# Altium schematic sheet Communication.SchDoc: Плата отладочная для выполнения лабораторных работ
size 420 x 297 mm; CheckedBy: Смирнов А. Н.; Author: Самарин И. Д.; CompanyName: МЭИ ЭР-02м-18; Address1: Address1; Address2: Address2; Address3: Address3; Address4: Address4; DocumentNumber: МЭИ.466219.001 Э3; SheetNumber: 5; Scale: 1:1; Title2str: по курсу "Информационная электроника"; DocumentType: Схема электрическая принципиальная; FirstReferrence: АБВГ.123456.001
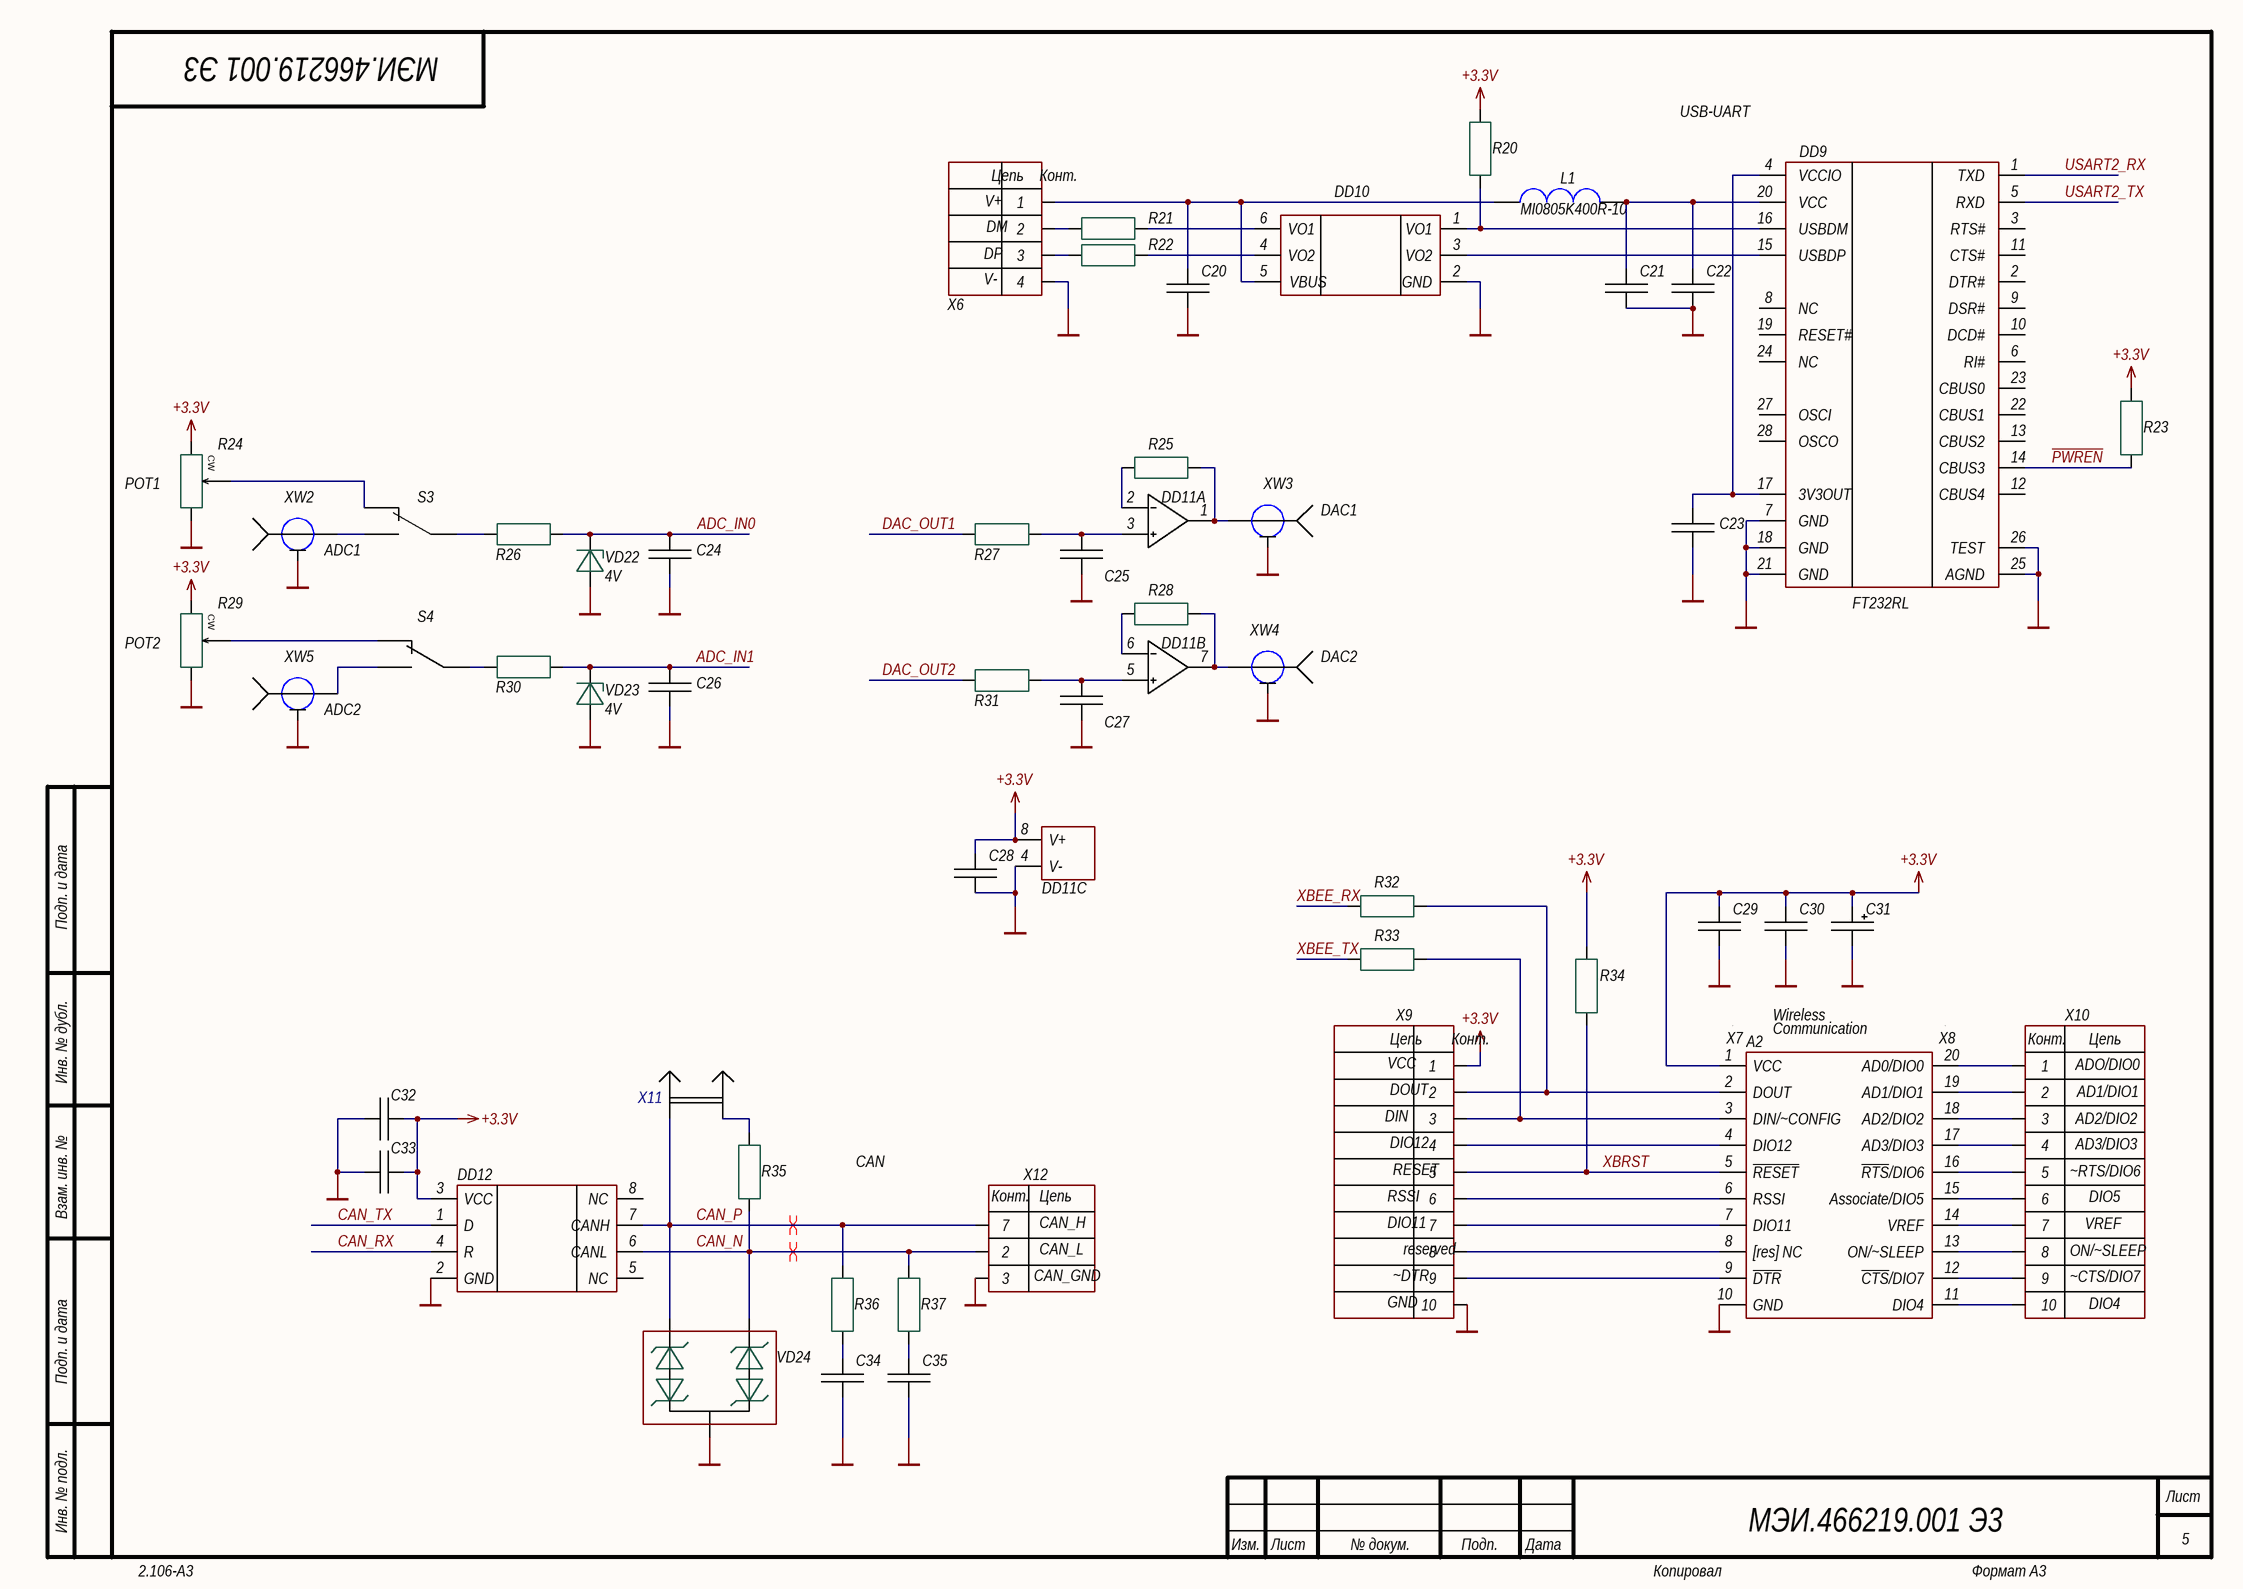
[diagram p0: Communication.SchDoc]

## Parts
A2  *  [XBee Standard]  (value not drawn)
C20  approved sub OK  [CAPC1608X90N]  (value not drawn)
C21  approved sub OK  [CAPC1608X90N]  (value not drawn)
C22  approved sub OK  [CAPC1608X90N]  (value not drawn)
C23  approved sub OK  [CAPC1608X90N]  (value not drawn)
C24  approved sub OK  [CAPC2012X135N]  (value not drawn)
C25  approved sub OK  [CAPC1608X90N]  (value not drawn)
C26  approved sub OK  [CAPC2012X135N]  (value not drawn)
C27  approved sub OK  [CAPC1608X90N]  (value not drawn)
C28  approved sub OK  [CAPC1608X90N]  (value not drawn)
C29  approved sub OK  [CAPC1608X90N]  (value not drawn)
C30  approved sub OK  [CAPC1608X90N]  (value not drawn)
C31  22µ  [CAPMP3216X180N]  (value not drawn)
C32  approved sub OK  [CAPC1608X90N]  (value not drawn)
C33  approved sub OK  [CAPC1608X90N]  (value not drawn)
C34  approved sub OK  [CAPC1608X90N]  (value not drawn)
C35  approved sub OK  [CAPC1608X90N]  (value not drawn)
DD9  FT232RL  [SOP65P780X200-28N]
DD10  USBLC6-2SC6  [SOT23-6]  (value not drawn)
DD11  LMH6646MA/NOPB  [SOIC127P600X175-8AN]  (value not drawn)  (parts A,B,C of 3)
DD12  SN65HVD232D  [SOIC127P600X175-8AN]  (value not drawn)
L1  Manufacturer Part Number 1: MI0805K400R-10  [FBC2012N]  (hidden comment: 2K2 @ 100 MHz)
R20  Thick Film  [RESC1608X55N]  (value not drawn)
R21  Thick Film  [RESC1608X55N]  (value not drawn)
R22  Thick Film  [RESC1608X55N]  (value not drawn)
R23  Thick Film  [RESC1608X55N]  (value not drawn)
R24  RK09K1130A5R  [Trimpot ADC]  (value not drawn)
R25  Thick Film  [RESC1608X55N]  (value not drawn)
R26  RC0603FR-071KL  [RESC1608X55N]  (value not drawn)
R27  RC0603FR-071KL  [RESC1608X55N]  (value not drawn)
R28  Thick Film  [RESC1608X55N]  (value not drawn)
R29  25 turns  [Trimpot ADC]  (value not drawn)
R30  RC0603FR-071KL  [RESC1608X55N]  (value not drawn)
R31  RC0603FR-071KL  [RESC1608X55N]  (value not drawn)
R32  Thick Film  [RESC1608X55N]  (value not drawn)
R33  Thick Film  [RESC1608X55N]  (value not drawn)
R34  Thick Film  [RESC1608X55N]  (value not drawn)
R35  Thick Film  [RESC1608X55N]  (value not drawn)
R36  Thick Film  [RESC1608X55N]  (value not drawn)
R37  Thick Film  [RESC1608X55N]  (value not drawn)
S3  ON-ON  [SWITCH_SPDT_SLIDER]  (value not drawn)
S4  ON-ON  [SWITCH_SPDT_SLIDER]  (value not drawn)
VD22  4V  [SOD323]
VD23  4V  [SOD323]
VD24  SM24CANA  [SOT23-3]  (value not drawn)
X6  USB-B  [USB_TypeB_Tyco]  (value not drawn)
X7  PBS2-10  [PBS2-10]  (value not drawn)
X8  PBS2-10  [PBS2-10]  (value not drawn)
X9  PBS10  [XBCON]  (value not drawn)
X10  PBS10  [XBCON]  (value not drawn)
X11  PLS-2  [HDR_1x2]  (value not drawn)
X12  DRB-9FA  [DB9]  (value not drawn)
XW2  BNC Fem. 50R  [BNC]  (value not drawn)
XW3  BNC Fem. 50R  [BNC]  (value not drawn)
XW4  BNC Fem. 50R  [BNC]  (value not drawn)
XW5  BNC Fem. 50R  [BNC]  (value not drawn)

## Nets
+3.3V: A2.1(VCC) C28.1 C29.1 C30.1 C31.1 C32.2 C33.2 DD11.8(V+) DD12.3(VCC) R20.2 R23.2 R24.CW R29.CW R34.2 X9.1
GND: A2.10(GND) C20.2 C21.2 C22.2 C23.2 C24.2 C25.2 C26.2 C27.2 C28.2 C29.2 C30.2 C31.2 C32.1 C33.1 C34.2 C35.2 DD9.7(GND) DD9.18(GND) DD9.21(GND) DD9.25(AGND) DD9.26(TEST) DD10.2(GND) DD11.4(V-) DD12.2(GND) R24.CCW R29.CCW VD22.A VD23.A VD24.3 X6.4 X9.10 X12.3 XW2.Case XW3.Case XW4.Case XW5.Case
ADC_IN0: C24.1 R26.2 VD22.K
ADC_IN1: C26.1 R30.2 VD23.K
CAN_N: DD12.6(CANL) R35.2 R37.2 VD24.1 X12.2
CAN_P: DD12.7(CANH) R36.2 VD24.2 X11.1 X12.7
CAN_RX: DD12.4(R)
CAN_TX: DD12.1(D)
DAC_OUT1: R27.2
DAC_OUT2: R31.2
~{PWREN}: DD9.14(CBUS3) R23.1
USART2_RX: DD9.1(TXD)
USART2_TX: DD9.5(RXD)
XBEE_RX: R32.1
XBEE_TX: R33.1
XBRST: A2.5(~{RESET}) R34.1 X9.5
NetA2_2: A2.2(DOUT) R32.2 X9.2
NetA2_3: A2.3(DIN/~CONFIG) R33.2 X9.3
NetA2_4: A2.4(DIO12) X9.4
NetA2_6: A2.6(RSSI) X9.6
NetA2_7: A2.7(DIO11) X9.7
NetA2_8: A2.8([res]_NC) X9.8
NetA2_9: A2.9(~{DTR}) X9.9
NetA2_11: A2.11(DIO4) X10.10
NetA2_12: A2.12(~{CTS}/DIO7) X10.9
NetA2_13: A2.13(ON/~SLEEP) X10.8
NetA2_14: A2.14(VREF) X10.7
NetA2_15: A2.15(Associate/DIO5) X10.6
NetA2_16: A2.16(~{RTS}/DIO6) X10.5
NetA2_17: A2.17(AD3/DIO3) X10.4
NetA2_18: A2.18(AD2/DIO2) X10.3
NetA2_19: A2.19(AD1/DIO1) X10.2
NetA2_20: A2.20(AD0/DIO0) X10.1
NetC20_1: C20.1 DD10.5(VBUS) L1.1(B) X6.1
NetC21_1: C21.1 C22.1 DD9.20(VCC) L1.2(CB)
NetC23_1: C23.1 DD9.4(VCCIO) DD9.17(3V3OUT)
NetC25_1: C25.1 DD11.3(+IN_A) R27.1
NetC27_1: C27.1 DD11.5(+IN_B) R31.1
NetC34_1: C34.1 R36.1
NetC35_1: C35.1 R37.1
NetDD9_15: DD9.15(USBDP) DD10.3(VO2)
NetDD9_16: DD9.16(USBDM) DD10.1(VO1) R20.1
NetDD10_4: DD10.4(VO2) R22.2
NetDD10_6: DD10.6(VO1) R21.2
NetDD11_1: DD11.1(OUT_A) R25.2 XW3.Sig
NetDD11_2: DD11.2(-IN_A) R25.1
NetDD11_6: DD11.6(-IN_B) R28.1
NetDD11_7: DD11.7(OUT_B) R28.2 XW4.Sig
NetR21_1: R21.1 X6.2
NetR22_1: R22.1 X6.3
NetR24_W: R24.W S3.3
NetR26_1: R26.1 S3.2
NetR29_W: R29.W S4.3
NetR30_1: R30.1 S4.2
NetR35_1: R35.1 X11.2
NetS3_1: S3.1 XW2.Sig
NetS4_1: S4.1 XW5.Sig

Not connected (* = marked no-connect by the designer): DD9 2(DTR#) 3(RTS#) 6(RI#) 8(NC) 9(DSR#) 10(DCD#) 11(CTS#) 12(CBUS4) 13(CBUS2) 19(RESET#) 22(CBUS1) 23(CBUS0) 24(NC) 27(OSCI) 28(OSCO); DD12 5(NC) 8(NC); X7 1(VCC); X8 1(VCC)

## Layout directives
differential pair: CAN_N, CAN_P

## Notes on the sheet
- USB-UART
- (near R24) POT1
- (near XW3) DAC1
- ADC1
- (near R29) POT2
- (near XW4) DAC2
- (near XW5) ADC2
- Wireless
- Communication
- CAN
- Подп. и дата
- Инв. № дубл.
- Взам. инв. №
- Инв. № подл.
- Изм.
- Лист
- № докум.
- Подп.
- Дата
- 2.106-A3
- Копировал
- Формат А3
- (in symbol DRB-9FA_1) Конт.; Цепь; CAN_H; CAN_L; CAN_GND
- (in symbol USB_TypeB) Цепь; Конт.; V+; DM; DP; V-
- (in symbol XBEE connector) Конт.; Цепь; ADO/DIO0; AD1/DIO1; AD2/DIO2; AD3/DIO3; ~RTS/DIO6; DIO5; VREF; ON/~SLEEP; ~CTS/DIO7; DIO4
- (in symbol XBEE connector_left) Цепь; Конт.; VCC; DOUT; DIN; DIO12; RESET; RSSI; DIO11; reserved; ~DTR; GND

## Library data of the parts
A2 = IC-RADIO-XBEE: XBEE module; ComponentLink1Designator: Compel; Model: *; ComponentLink1URL: *
C20 = CAPC_10n_0603_X7R_50V_10%: Capacitor SMD Cer 10nF 10% 50V X7R 0603; Manufacturer 1: TDK Corporation; Manufacturer Part Number 1: C1608X7R1H103K; Ratings: 50V; X7R; Material: ceramic; SCDType: spec; Value: 10n; Package / Case: 0603 (1608 metric); Tolerance: ±10%; Supplier 1: Digi-Key; Supplier Part Number 1: 445-1311-1-ND; ComponentLink1URL: http://product.tdk.com/capacitor/mlcc/en/documents/mlcc_commercial_general_en.pdf; ComponentLink1Description: http://product.tdk.com/capacitor/mlcc/en/documents/mlcc_commercial_general_en.pdf; Supplier 2: Digi-Key; Supplier Part Number 2: 478-1227-1-ND; Manufacturer 2: AVX Corporation; Manufacturer Part Number 2: 06035C103KAT2A; ComponentLink2URL: https://www.compel.ru/infosheet/TDK/C1608X7R1H103K080AA; ComponentLink2Description: Compel
C21 C23 C28 C29 C32 = CAPC_100n_0603_X7R_50V_10%: Capacitor SMD Cer 100nF 10% 50V X7R 0603; Manufacturer 1: TDK Corporation; Manufacturer Part Number 1: C1608X7R1H104K; Ratings: 50V; X7R; Material: ceramic; SCDType: spec; Value: 100n; Package / Case: 0603 (1608 Metric); Tolerance: ±10%; Supplier 1: Compel; Supplier Part Number 1: *; ComponentLink1URL: https://www.compel.ru/infosheet/TDK/C1608X7R1H104KT; ComponentLink1Description: Compel; Supplier Part Number 2: *
C22 = CAPC_4u7_0603: Capacitor SMD Cer 4.7uF 10% 16V X5R 0805; Manufacturer 1: TDK Co.; Manufacturer Part Number 1: C1608X5R1E475K080AC; Ratings: 25V; X5R; Material: ceramic; SCDType: spec; Value: 4µ7; Package / Case: 0603 (1608 Metric); Tolerance: ±10%; Supplier 1: Digi-Key; Supplier Part Number 1: 587-1294-1-ND; Operating Temperature: -55°C ~ 85°C; Size / Dimension: 0.079" L x 0.049" W (2.00mm x 1.25mm); Thickness (Max): 0.053" (1.35mm); ComponentLink1URL: https://www.compel.ru/infosheet/TDK/C1608X5R1E475K080AC; ComponentLink1Description: Compel; Supplier 2: Digi-Key; Supplier Part Number 2: 1276-1065-1-ND; Manufacturer 2: Samsung Electro-Mechanics America, Inc; Manufacturer Part Number 2: CL21A475KOFNNNE; RoHS 2: RoHS Compliant; ComponentLink2URL: http://www.samsungsem.com/servlet/FileDownload?type=spec&file=CL21A475KOFNNNE.pdf; ComponentLink2Description: http://www.samsungsem.com/servlet/FileDownload?type=spec&file=CL21A475KOFNNNE.pdf; Supplier 3: Digi-Key; Supplier Part Number 3: 399-8101-1-ND; Manufacturer 3: Kemet; Manufacturer Part Number 3: C0805C475K4PACTU; RoHS 3: RoHS Compliant; ComponentLink3URL: http://capacitoredge.kemet.com/capedge2/DataSheet?pn=C0805C475K4PACTU; ComponentLink3Description: http://capacitoredge.kemet.com/capedge2/DataSheet?pn=C0805C475K4PACTU; Supplier 4: Digi-Key; Supplier Part Number 4: 490-7215-1-ND; Manufacturer 4: Murata Electronics North America; Manufacturer Part Number 4: GRM21BR61C475MA88L; RoHS 4: RoHS Compliant; ComponentLink4URL: http://psearch.murata.com/capacitor/product/GRM21BR61C475MA88#.pdf; ComponentLink4Description: http://psearch.murata.com/capacitor/product/GRM21BR61C475MA88#.pdf; Supplier 5: Digi-Key; Supplier Part Number 5: 445-7640-1-ND; Manufacturer 5: Taiyo Yuden; Manufacturer Part Number 5: EMK212BJ475KG-T; RoHS 5: RoHS Compliant; ComponentLink5URL: http://www.yuden.co.jp/productdata/catalog/en/mlcc01_e.pdf; ComponentLink5Description: http://www.yuden.co.jp/productdata/catalog/en/mlcc01_e.pdf; RoHS 1: RoHS Compliant
C24 C26 = CAPC_330n_0805_X7R_25V_10%: Capacitor SMD Cer 330nF 10% 25V X7R 0805; Manufacturer 1: Kemet; Manufacturer Part Number 1: C0805C334K3RACTU; Ratings: 25V; X7R; Material: ceramic; SCDType: spec; Value: 330n; Package / Case: 0805 (2012 metric); Tolerance: ±10%; ComponentLink1URL: https://www.compel.ru/infosheet/KEM/C0805C334K3RACTU; ComponentLink1Description: Compel; Supplier 1: Compel; Supplier Part Number 1: *
C25 C27 = CAPC_1u_0603_X7R_16V_10%: Capacitor SMD Cer 1uF 10% 16V X7R 0603; Manufacturer 1: TDK Corporation; Manufacturer Part Number 1: C1608X7R1A105K080AC; Ratings: 16V; X7R; Material: ceramic; SCDType: spec; Value: 1µ; Package / Case: 0603 (1608 metric); Tolerance: ±10%; Supplier 1: Compel; Supplier Part Number 1: 445-1604-1-ND; ComponentLink1URL: https://www.compel.ru/infosheet/TDK/C1608X7R1A105K080AC; ComponentLink1Description: Compel
C30 C33 = CAPC_10u_0805_10V: Capacitor SMD Cer 10uF 10% 10V X5R 0603; Manufacturer 1: TDK Corporation; Manufacturer Part Number 1: C1608X5R1A106K080AC; Ratings: 10V; X5R; Material: ceramic; Value: 10µ; SCDType: spec; Package / Case: 0603 (1608 Metric); Tolerance: ±10%; Supplier Part Number 1: *; ComponentLink1URL: https://www.compel.ru/infosheet/TDK/C1608X5R1A106K080AC; ComponentLink1Description: Compel; Supplier 1: Compel
C31 = CAPT_22u_3216_6V3: Capacitor SMD Tantalum 22uF 10% 6.3V 3216-18; Manufacturer 1: Kemet; Manufacturer Part Number 1: T491A226K006AT; Material: Solid Tantalum; SCDType: source; Package / Case: EIA 535BAAC size A; Ratings: 6.3V; Tolerance: ±10%; Supplier 1: Digi-Key; Supplier Part Number 1: 399-8279-1-ND; ComponentLink1URL: https://www.compel.ru/infosheet/KEM/T491A226K006AT; ComponentLink1Description: Compel; Supplier 2: Digi-Key; Supplier Part Number 2: 718-1139-1-ND; Manufacturer 2: Vishay Sprague; Manufacturer Part Number 2: 293D226X96R3A2TE3; ComponentLink2URL: http://www.vishay.com/doc?40002; ComponentLink2Description: http://www.vishay.com/doc?40002; Supplier 3: Digi-Key; Supplier Part Number 3: 478-3865-1-ND; Manufacturer 3: AVX Corporation; Manufacturer Part Number 3: TAJA226K006RNJ; ComponentLink3URL: http://www.avx.com/docs/Catalogs/taj.pdf; ComponentLink3Description: http://www.avx.com/docs/Catalogs/taj.pdf; Value: 22µ
C34 C35 = CAPC_560p_0603_NP0_50V_5%: Capacitor SMD Cer 560pF 5% 50V NP0 0603; Manufacturer 1: KEMET; Manufacturer Part Number 1: C0603C561K8RACTU; Ratings: 10V; Material: ceramic; Capacitance: 470pF; SCDType: spec; Value: 560p; Package / Case: 0603 (1608 metric); Voltage - Rated: 50V; Mounting Type: Surface Mount, MLCC; Operating Temperature: -55°C ~ 125°C; Applications: General Purpose; Size / Dimension: 0.063" L x 0.032" W (1.60mm x 0.81mm); Height - Seated (Max): -; Thickness (Max): 0.035" (0.90mm); Lead Spacing: -; Lead Style: -; ComponentLink1URL: https://www.compel.ru/infosheet/KEM/C0603C561K8RACTU; ComponentLink1Description: Compel; Tolerance: ±5%; Supplier Part Number: *; Supplier 1: Compel
DD9 = FT232: USB-UART converter; Manufacture: FUTURE Technology Devices Int. Ltd.; HelpURL: https://www.compel.ru/infosheet/FTDI/FT232RLR-C; Case: SSOP-28; Model: FT232RL
DD10 = USBLC6-2SC6: Protect; Manufacture: ST Microelectronics; HelpURL: https://www.compel.ru/infosheet/ST/USBLC6-2SC6; Case: SOT236; Model: USBLC6-2SC6
DD11 = LMH6646: Rail-to-Rail Input and Output Amplifiers  with Shutdown Option; Manufacture: TI; HelpURL: *; Case: SOIC-8 (D0008A, 4.9 x 3.9); Model: LMH6646MA/NOPB
DD12 = SN65HVD230 3.3-V: Protect; Manufacture: TI; HelpURL: https://www.compel.ru/infosheet/TI/SN65HVD232D; Case: so-8; Model: SN65HVD232D
L1 = FERRITE_MI0805K400R-10_0805: Ferrite bead 2.2K Ohm at 100 MHz 200mA 0603 SMD; Manufacturer 1: STEWARD Inc.; Ratings: 200 mA; 800 mOhm DC; SCDType: source; Size / Dimension: 0805; Impedance @ Frequency: *; Current Rating: *; DC Resistance (DCR): *; Filter Type: *; Package / Case: 0805; Height (Max): *; Mounting Type: Surface Mount; Supplier 1: Digi-Key; Supplier Part Number 1: 445-8671-1-ND; RoHS 1: RoHS Compliant; ComponentLink1URL: https://www.compel.ru/infosheet/STEWARD/MI0805K400R-10; ComponentLink1Description: Compel; Value: 2K2 @ 100 MHz
R20 = RES_4K7_0603_1%: Resistor SMD chip 4.7K Ohm 0.1W 1% 0603; Manufacturer Part Number 1: RC0603FR-074K7L; Manufacturer 1: Yageo; Ratings: 1/10W; SCDType: undef; Value: 4K7; ComponentLink1Designator: Compel; Package / Case: 0603 (1608 Metric); Supplier 1: Compel; Supplier Part Number 1: 311-4.70KHRCT-ND; Tolerance: ±1%; ComponentLink1URL: https://www.compel.ru/infosheet/YAG/RC0603FR-074K7L
R21 R22 R32 R33 = RES_22R_0603_5%: Resistor SMD chip 22 Ohm 0.1W 5% 0603; Manufacturer 1: Yageo; Manufacturer Part Number 1: RC0603JR-0722RL; Tolerance: ±1%; Ratings: 1/10W; SCDType: spec; Temperature Coefficient: ±100ppm/°C; Value: 22R; Package / Case: 0603 (1608 metric); Case: 0603 (1608 metric); Supplier 1: Compel; Supplier Part Number 1: RC0603FR-0722RL; RoHS 1: RoHS Compliant; ComponentLink1URL: https://www.compel.ru/infosheet/YAG/RC0603FR-0722RL; ComponentLink1Description: Compel; Supplier 2: Digi-Key; Supplier Part Number 2: 1276-5022-6-ND; Manufacturer 2: Samsung Electro-Mechanics America, Inc; Manufacturer Part Number 2: RC1608J220CS; RoHS 2: RoHS Compliant; ComponentLink2URL: http://www.samsungsem.com/servlet/FileDownload?filename=productcatalog/pdf/Chip_Resistor.pdf; ComponentLink2Description: http://www.samsungsem.com/servlet/FileDownload?filename=productcatalog/pdf/Chip_Resistor.pdf; Supplier 3: Digi-Key; Supplier Part Number 3: RMCF0603JT22R0DKR-ND; Manufacturer 3: Stackpole Electronics Inc; Manufacturer Part Number 3: RMCF0603JT22R0; RoHS 3: RoHS Compliant; ComponentLink3URL: http://www.seielect.com/Catalog/SEI-RMCF_RMCP.pdf; ComponentLink3Description: http://www.seielect.com/Catalog/SEI-RMCF_RMCP.pdf; Supplier 4: Digi-Key; Supplier Part Number 4: RHM22CGDKR-ND; Manufacturer 4: Rohm Semiconductor; Manufacturer Part Number 4: MCR03ERTJ220; RoHS 4: RoHS Compliant; ComponentLink4URL: http://rohmfs.rohm.com/en/products/databook/datasheet/passive/resistor/chip_resistor/mcr_g.pdf; ComponentLink4Description: http://rohmfs.rohm.com/en/products/databook/datasheet/passive/resistor/chip_resistor/mcr_g.pdf; Supplier 5: Digi-Key; Supplier Part Number 5: P22GDKR-ND; Manufacturer 5: Panasonic Electronic Components; Manufacturer Part Number 5: ERJ-3GEYJ220V; RoHS 5: RoHS Compliant; ComponentLink5URL: http://industrial.panasonic.com/www-cgi/jvcr13pz.cgi?E+PZ+3+AOA0001+ERJ3GEYJ220V+7+WW; ComponentLink5Description: http://industrial.panasonic.com/www-cgi/jvcr13pz.cgi?E+PZ+3+AOA0001+ERJ3GEYJ220V+7+WW
R23 R34 = RES_10K_0603_1%: Resistor SMD chip 10k Ohm 0.1W 1% 0603; Manufacturer 1: Yageo; Manufacturer Part Number 1: RC0603FR-0710KL; Ratings: 1/10W; SCDType: spec; ComponentLink1Designator: Compel; Package / Case: 0603 (1608 Metric); Supplier 1: Compel; Supplier Part Number 1: 311-10.0KHRCT-ND; Tolerance: ±1%; Value: 10K; ComponentLink1URL: https://www.compel.ru/infosheet/YAG/RC0603FR-0710KL
R24 = RES_TRIMMER_10K_ADC: Trimmer THD 20K 500mW 25-turn; Manufacturer 1: ALPS Electric Co., Ltd.; Tolerance: ±20%; Ratings: 1/2W; ±100ppm/°C; SCDType: spec; ComponentLink1Designator: Compel; Value: 10K; Material: Cermet; Package / Case: 10.9mm L x 5.0mm W x 10.0mm H; Supplier 1: Kompel; Supplier Part Number 1: 490-2900-ND; Manufacturer Part Number 1: RK09K1130A5R; ComponentLink1URL: https://www.compel.ru/infosheet/ALPS/RK09K1130A5R
R25 R28 R36 R37 = RES_100R_0603_1%: Resistor SMD chip 100 Ohm 0.1W 1% 0603; Manufacturer 1: Yageo; Manufacturer Part Number 1: RC0603FR-07100RL; Ratings: 1/10 W; SCDType: spec; Value: 100R; Package / Case: 0603 (1608 Metric); Material: Thick Film; Supplier 1: Compel; Supplier Part Number 1: 311-100HRCT-ND; Supplier 2: Digi-Key; Supplier Part Number 2: P100HTR-ND; Manufacturer 2: Panasonic - ECG; Manufacturer Part Number 2: ERJ-3EKF1000V; ComponentLink1URL: https://www.compel.ru/infosheet/YAG/RC0603FR-07100RL; ComponentLink1Description: Compel; Tolerance: ±1%
R26 R27 R30 R31 = RES_1K_0603_1%: Resistor SMD chip 1k Ohm 0.1W 1% 0603; Manufacturer 1: Yageo; Ratings: 1/10W; SCDType: spec; Package / Case: 0603 (1608 Metric); Manufacturer Part Number 1: RC0603FR-071KL; Supplier 1: Compel; Supplier Part Number 1: 311-1.00KHRCT-ND; Tolerance: ±1%; Value: 1K; ComponentLink1URL: https://www.compel.ru/infosheet/YAG/RC0603FR-071KL; ComponentLink1Description: Compel
R29 = RES_TRIMMER_10K_ADC: Trimmer THD 20K 500mW 25-turn; Manufacturer 1: ALPS Electric Co., Ltd.; Manufacturer Part Number 1: RK09K1130A5R; Tolerance: ±20%; Ratings: 1/2W; ±100ppm/°C; SCDType: spec; ComponentLink1Designator: Compel; Value: 10K; Material: Cermet; Package / Case: 10.9mm L x 5.0mm W x 10.0mm H; Supplier 1: Kompel; Supplier Part Number 1: 490-2900-ND; ComponentLink1URL: https://www.compel.ru/infosheet/ALPS/RK09K1130A5R
R35 = RES_120R_0603_5%: Resistor SMD chip 120 Ohm 0.1W 5% 0603; Manufacturer 1: Yageo; Manufacturer Part Number 1: RC0603FR-07120RL; Ratings: 1/10 W; Tolerance: ±1%; SCDType: spec; Value: 120R; Package / Case: 0603 (1608 metric); Material: Thick Film; Supplier 1: Compel; Supplier Part Number 1: 541-120GCT-ND; ComponentLink1URL: http://www.vishay.com/doc?20035; ComponentLink1Description: Compel; Supplier 2: Digi-Key; Supplier Part Number 2: 311-120GRCT-ND; Manufacturer 2: Yageo; Manufacturer Part Number 2: *; ComponentLink2URL: http://www.yageo.com/documents/recent/PYu-RC0603_51_RoHS_L_4.pdf; ComponentLink2Description: http://www.yageo.com/documents/recent/PYu-RC0603_51_RoHS_L_4.pdf
S3 S4 = SW_THD_SPDT_On-On: Switch THD vertical toggle SPDT; Manufacturer 1: TE Connectivity; Manufacturer Part Number 1: SLS121PC04; Contact Rating @ Voltage: 0.25A @ 125VAC; SCDType: spec; ComponentLink1Designator: Compel; Circuit: SPDT; Mounting Type: PCB mount; Supplier 1: Compel; Supplier Part Number 1: 450-1598-ND; Switch Function: On-On; ComponentLink1URL: https://www.compel.ru/infosheet/TE/SLS121PC04
VD22 VD23 = DIODE_ZENER_4V_SOD323: Diode Zener SMD 4V 200mW SOD-323; Manufacturer 1: Diotec Semiconductor; Manufacturer Part Number 1: MM3Z3V6; Ratings: 4V; 0.2W;; Material: Si; Tolerance: ±3%; SCDType: source; ComponentLink1Designator: Kompel; Package / Case: SOD-323; Diode Type: Zener; Supplier 1: Kompel; Supplier Part Number 1: MM3Z3V3ST1GOSCT-ND; ComponentLink1URL: https://www.compel.ru/infosheet/DIOTEC/MM3Z3V6
VD24 = SM24CANA: TVS Diode Array; Manufacture: Littelfuse; Model: SM24CANA-02HTG; HelpURL: https://www.compel.ru/wordpress/wp-content/uploads/2017/03/Littelfuse_SM24CANA.pdf; Case: DO-41
X6 = USB_TypeB: Connector THT Type B USB connector; Manufacturer Part Number 1: 0670680000; Manufacturer 1: Molex; Specifications: USB 2.0; SCDType: undef; ComponentLink1Designator: Compel; Package / Case: R/A Type B; Supplier 1: Digi-Key; Connector Type: USB - B; Supplier Part Number 1: A31725-ND; ComponentLink1URL: https://www.compel.ru/infosheet/MOL/0670680000
X7 X8 = CONN XBEE: Manufacture: CONNFLY; ComponentLink1Designator: Compel; ComponentLink1URL: https://www.compel.ru/infosheet/CONNFLY/PBS2-10; Model: PBS2-10
X9 = XBEE connector_left: External; Manufacture: NINGBO KLS Electronic Co.,Ltd.; HelpURL: https://www.compel.ru/infosheet/KLS/PBS-10; Case: *; Model: PBS10
X10 = XBEE connector: External; Manufacture: NINGBO KLS Electronic Co.,Ltd.; HelpURL: https://www.compel.ru/infosheet/KLS/PBS-10; Case: *; Model: PBS10
X11 = PLS-2 _1: Jumper; Manufacture: NINGBO KLS Electronic Co.,Ltd.; Model: PLS-2; HelpURL: https://www.compel.ru/infosheet/KLS/PLS-2
X12 = DRB-9FA_1: Conector CAN; Manufacture: Connfly; Model: DRB-9FA; Case: DB9; ComponentLink1Description: COMPEL; ComponentLink1URL: https://www.compel.ru/infosheet/CONNFLY/DRB-9FA
XW2-XW5 = CONN_BNC: BNC; Manufacturer 1: TE Connectivity; Manufacturer Part Number 1: 413969-2; Impedance: 50 Ohm; Ratings: 9400pF; 1500V; SCDType: undef; Category: Connectors; Mounting Type: Through Hole; Supplier 1: Digi-Key; Supplier Part Number 1: A32418-ND; ComponentLink1URL: https://www.compel.ru/infosheet/TE/413969-2; ComponentLink1Description: Compel